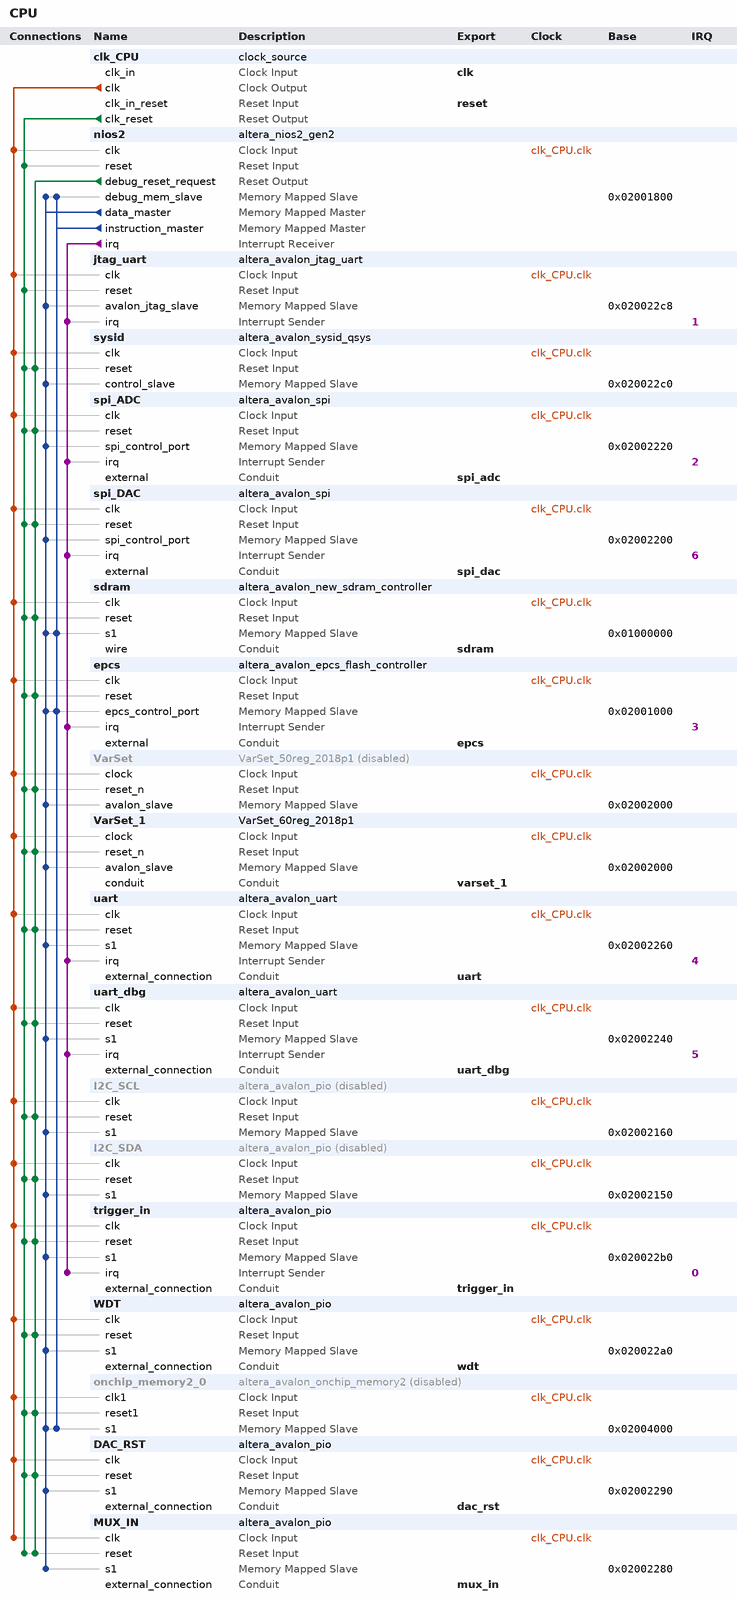
[diagram p0: system contents]
# Platform Designer (Qsys) system CPU, Cyclone IV E EP4CE40F23I7
# Parameters at their usual value, and those the tool derives, are not listed.
package require -exact qsys 18.1
create_system CPU
set_project_property DEVICE_FAMILY {Cyclone IV E}
set_project_property DEVICE EP4CE40F23I7

add_instance clk_CPU clock_source 18.1
set_instance_parameter_value clk_CPU clockFrequency 100000000

add_instance nios2 altera_nios2_gen2 18.1
set_instance_parameter_value nios2 dcache_size 2048
set_instance_parameter_value nios2 exceptionSlave sdram.s1
set_instance_parameter_value nios2 icache_size 4096
set_instance_parameter_value nios2 impl Tiny
set_instance_parameter_value nios2 resetSlave epcs.epcs_control_port

add_instance jtag_uart altera_avalon_jtag_uart 18.1
set_instance_parameter_value jtag_uart simInteractiveOptions NO_INTERACTIVE_WINDOWS

add_instance sysid altera_avalon_sysid_qsys 18.1
set_instance_parameter_value sysid id 16777216

add_instance spi_ADC altera_avalon_spi 18.1
set_instance_parameter_value spi_ADC clockPolarity 0
set_instance_parameter_value spi_ADC dataWidth 16
set_instance_parameter_value spi_ADC masterSPI true
set_instance_parameter_value spi_ADC numberOfSlaves 2
set_instance_parameter_value spi_ADC targetClockRate 1000000

add_instance spi_DAC altera_avalon_spi 18.1
set_instance_parameter_value spi_DAC clockPolarity 0
set_instance_parameter_value spi_DAC dataWidth 16
set_instance_parameter_value spi_DAC masterSPI true
set_instance_parameter_value spi_DAC numberOfSlaves 2
set_instance_parameter_value spi_DAC targetClockRate 1000000

add_instance sdram altera_avalon_new_sdram_controller 18.1
set_instance_parameter_value sdram TAC 5.4
set_instance_parameter_value sdram TRCD 18.0
set_instance_parameter_value sdram TRFC 60.0
set_instance_parameter_value sdram TRP 18.0
set_instance_parameter_value sdram casLatency 3
set_instance_parameter_value sdram columnWidth 9
set_instance_parameter_value sdram dataWidth 16
set_instance_parameter_value sdram generateSimulationModel false
set_instance_parameter_value sdram model single_Micron_MT48LC4M32B2_7_chip
set_instance_parameter_value sdram numberOfBanks 4
set_instance_parameter_value sdram numberOfChipSelects 1
set_instance_parameter_value sdram powerUpDelay 100.0
set_instance_parameter_value sdram refreshPeriod 15.625
set_instance_parameter_value sdram rowWidth 12

add_instance epcs altera_avalon_epcs_flash_controller 18.1
set_instance_parameter_value epcs resetrequest_enabled true

add_instance VarSet VarSet_50reg_2018p1 1.0
set_instance_property VarSet ENABLED false

add_instance VarSet_1 VarSet_60reg_2018p1 2.0

add_instance uart altera_avalon_uart 18.1
set_instance_parameter_value uart baud 115200
set_instance_parameter_value uart dataBits 8
set_instance_parameter_value uart fixedBaud false
set_instance_parameter_value uart parity NONE
set_instance_parameter_value uart stopBits 1

add_instance uart_dbg altera_avalon_uart 18.1
set_instance_parameter_value uart_dbg baud 115200
set_instance_parameter_value uart_dbg dataBits 8
set_instance_parameter_value uart_dbg fixedBaud true
set_instance_parameter_value uart_dbg parity NONE
set_instance_parameter_value uart_dbg stopBits 1

add_instance I2C_SCL altera_avalon_pio 18.1
set_instance_property I2C_SCL ENABLED false
set_instance_parameter_value I2C_SCL direction Output
set_instance_parameter_value I2C_SCL width 1

add_instance I2C_SDA altera_avalon_pio 18.1
set_instance_property I2C_SDA ENABLED false
set_instance_parameter_value I2C_SDA direction Bidir
set_instance_parameter_value I2C_SDA width 1

add_instance trigger_in altera_avalon_pio 18.1
set_instance_parameter_value trigger_in bitClearingEdgeCapReg true
set_instance_parameter_value trigger_in captureEdge true
set_instance_parameter_value trigger_in direction Input
set_instance_parameter_value trigger_in generateIRQ true
set_instance_parameter_value trigger_in irqType EDGE
set_instance_parameter_value trigger_in width 1

add_instance WDT altera_avalon_pio 18.1
set_instance_parameter_value WDT direction Output
set_instance_parameter_value WDT width 2

add_instance onchip_memory2_0 altera_avalon_onchip_memory2 18.1
set_instance_property onchip_memory2_0 ENABLED false
set_instance_parameter_value onchip_memory2_0 dataWidth 32
set_instance_parameter_value onchip_memory2_0 dualPort false
set_instance_parameter_value onchip_memory2_0 initMemContent true
set_instance_parameter_value onchip_memory2_0 initializationFileName onchip_mem.hex
set_instance_parameter_value onchip_memory2_0 memorySize 16384

add_instance DAC_RST altera_avalon_pio 18.1
set_instance_parameter_value DAC_RST direction Output
set_instance_parameter_value DAC_RST resetValue 1
set_instance_parameter_value DAC_RST width 1

add_instance MUX_IN altera_avalon_pio 18.1
set_instance_parameter_value MUX_IN direction Output
set_instance_parameter_value MUX_IN width 2

# connections
add_connection clk_CPU.clk DAC_RST.clk clock
add_connection clk_CPU.clk epcs.clk clock
add_connection clk_CPU.clk I2C_SCL.clk clock
add_connection clk_CPU.clk I2C_SDA.clk clock
add_connection clk_CPU.clk jtag_uart.clk clock
add_connection clk_CPU.clk MUX_IN.clk clock
add_connection clk_CPU.clk nios2.clk clock
add_connection clk_CPU.clk onchip_memory2_0.clk1 clock
add_connection clk_CPU.clk sdram.clk clock
add_connection clk_CPU.clk spi_ADC.clk clock
add_connection clk_CPU.clk spi_DAC.clk clock
add_connection clk_CPU.clk sysid.clk clock
add_connection clk_CPU.clk trigger_in.clk clock
add_connection clk_CPU.clk uart.clk clock
add_connection clk_CPU.clk uart_dbg.clk clock
add_connection clk_CPU.clk VarSet.clock clock
add_connection clk_CPU.clk VarSet_1.clock clock
add_connection clk_CPU.clk WDT.clk clock
add_connection clk_CPU.clk_reset DAC_RST.reset reset
add_connection clk_CPU.clk_reset epcs.reset reset
add_connection clk_CPU.clk_reset I2C_SCL.reset reset
add_connection clk_CPU.clk_reset I2C_SDA.reset reset
add_connection clk_CPU.clk_reset jtag_uart.reset reset
add_connection clk_CPU.clk_reset MUX_IN.reset reset
add_connection clk_CPU.clk_reset nios2.reset reset
add_connection clk_CPU.clk_reset onchip_memory2_0.reset1 reset
add_connection clk_CPU.clk_reset sdram.reset reset
add_connection clk_CPU.clk_reset spi_ADC.reset reset
add_connection clk_CPU.clk_reset spi_DAC.reset reset
add_connection clk_CPU.clk_reset sysid.reset reset
add_connection clk_CPU.clk_reset trigger_in.reset reset
add_connection clk_CPU.clk_reset uart.reset reset
add_connection clk_CPU.clk_reset uart_dbg.reset reset
add_connection clk_CPU.clk_reset VarSet.reset_n reset
add_connection clk_CPU.clk_reset VarSet_1.reset_n reset
add_connection clk_CPU.clk_reset WDT.reset reset
add_connection nios2.debug_reset_request DAC_RST.reset reset
add_connection nios2.debug_reset_request epcs.reset reset
add_connection nios2.debug_reset_request I2C_SCL.reset reset
add_connection nios2.debug_reset_request I2C_SDA.reset reset
add_connection nios2.debug_reset_request MUX_IN.reset reset
add_connection nios2.debug_reset_request onchip_memory2_0.reset1 reset
add_connection nios2.debug_reset_request sdram.reset reset
add_connection nios2.debug_reset_request spi_ADC.reset reset
add_connection nios2.debug_reset_request spi_DAC.reset reset
add_connection nios2.debug_reset_request sysid.reset reset
add_connection nios2.debug_reset_request trigger_in.reset reset
add_connection nios2.debug_reset_request uart.reset reset
add_connection nios2.debug_reset_request uart_dbg.reset reset
add_connection nios2.debug_reset_request VarSet.reset_n reset
add_connection nios2.debug_reset_request VarSet_1.reset_n reset
add_connection nios2.debug_reset_request WDT.reset reset
add_connection nios2.data_master DAC_RST.s1 avalon
set_connection_parameter_value nios2.data_master/DAC_RST.s1 baseAddress 0x02002290
add_connection nios2.data_master epcs.epcs_control_port avalon
set_connection_parameter_value nios2.data_master/epcs.epcs_control_port baseAddress 0x02001000
add_connection nios2.data_master I2C_SCL.s1 avalon
set_connection_parameter_value nios2.data_master/I2C_SCL.s1 baseAddress 0x02002160
add_connection nios2.data_master I2C_SDA.s1 avalon
set_connection_parameter_value nios2.data_master/I2C_SDA.s1 baseAddress 0x02002150
add_connection nios2.data_master jtag_uart.avalon_jtag_slave avalon
set_connection_parameter_value nios2.data_master/jtag_uart.avalon_jtag_slave baseAddress 0x020022c8
add_connection nios2.data_master MUX_IN.s1 avalon
set_connection_parameter_value nios2.data_master/MUX_IN.s1 baseAddress 0x02002280
add_connection nios2.data_master nios2.debug_mem_slave avalon
set_connection_parameter_value nios2.data_master/nios2.debug_mem_slave baseAddress 0x02001800
add_connection nios2.data_master onchip_memory2_0.s1 avalon
set_connection_parameter_value nios2.data_master/onchip_memory2_0.s1 baseAddress 0x02004000
add_connection nios2.data_master sdram.s1 avalon
set_connection_parameter_value nios2.data_master/sdram.s1 baseAddress 0x01000000
add_connection nios2.data_master spi_ADC.spi_control_port avalon
set_connection_parameter_value nios2.data_master/spi_ADC.spi_control_port baseAddress 0x02002220
add_connection nios2.data_master spi_DAC.spi_control_port avalon
set_connection_parameter_value nios2.data_master/spi_DAC.spi_control_port baseAddress 0x02002200
add_connection nios2.data_master sysid.control_slave avalon
set_connection_parameter_value nios2.data_master/sysid.control_slave baseAddress 0x020022c0
add_connection nios2.data_master trigger_in.s1 avalon
set_connection_parameter_value nios2.data_master/trigger_in.s1 baseAddress 0x020022b0
add_connection nios2.data_master uart.s1 avalon
set_connection_parameter_value nios2.data_master/uart.s1 baseAddress 0x02002260
add_connection nios2.data_master uart_dbg.s1 avalon
set_connection_parameter_value nios2.data_master/uart_dbg.s1 baseAddress 0x02002240
add_connection nios2.data_master VarSet.avalon_slave avalon
set_connection_parameter_value nios2.data_master/VarSet.avalon_slave baseAddress 0x02002000
add_connection nios2.data_master VarSet_1.avalon_slave avalon
set_connection_parameter_value nios2.data_master/VarSet_1.avalon_slave baseAddress 0x02002000
add_connection nios2.data_master WDT.s1 avalon
set_connection_parameter_value nios2.data_master/WDT.s1 baseAddress 0x020022a0
add_connection nios2.instruction_master epcs.epcs_control_port avalon
set_connection_parameter_value nios2.instruction_master/epcs.epcs_control_port baseAddress 0x02001000
add_connection nios2.instruction_master nios2.debug_mem_slave avalon
set_connection_parameter_value nios2.instruction_master/nios2.debug_mem_slave baseAddress 0x02001800
add_connection nios2.instruction_master onchip_memory2_0.s1 avalon
set_connection_parameter_value nios2.instruction_master/onchip_memory2_0.s1 baseAddress 0x02004000
add_connection nios2.instruction_master sdram.s1 avalon
set_connection_parameter_value nios2.instruction_master/sdram.s1 baseAddress 0x01000000
add_connection nios2.irq epcs.irq interrupt
set_connection_parameter_value nios2.irq/epcs.irq irqNumber 3
add_connection nios2.irq jtag_uart.irq interrupt
set_connection_parameter_value nios2.irq/jtag_uart.irq irqNumber 1
add_connection nios2.irq spi_ADC.irq interrupt
set_connection_parameter_value nios2.irq/spi_ADC.irq irqNumber 2
add_connection nios2.irq spi_DAC.irq interrupt
set_connection_parameter_value nios2.irq/spi_DAC.irq irqNumber 6
add_connection nios2.irq trigger_in.irq interrupt
set_connection_parameter_value nios2.irq/trigger_in.irq irqNumber 0
add_connection nios2.irq uart.irq interrupt
set_connection_parameter_value nios2.irq/uart.irq irqNumber 4
add_connection nios2.irq uart_dbg.irq interrupt
set_connection_parameter_value nios2.irq/uart_dbg.irq irqNumber 5

# exported interfaces
add_interface clk clock sink
set_interface_property clk EXPORT_OF clk_CPU.clk_in
add_interface dac_rst conduit end
set_interface_property dac_rst EXPORT_OF DAC_RST.external_connection
add_interface epcs conduit end
set_interface_property epcs EXPORT_OF epcs.external
add_interface mux_in conduit end
set_interface_property mux_in EXPORT_OF MUX_IN.external_connection
add_interface reset reset sink
set_interface_property reset EXPORT_OF clk_CPU.clk_in_reset
add_interface sdram conduit end
set_interface_property sdram EXPORT_OF sdram.wire
add_interface spi_adc conduit end
set_interface_property spi_adc EXPORT_OF spi_ADC.external
add_interface spi_dac conduit end
set_interface_property spi_dac EXPORT_OF spi_DAC.external
add_interface trigger_in conduit end
set_interface_property trigger_in EXPORT_OF trigger_in.external_connection
add_interface uart conduit end
set_interface_property uart EXPORT_OF uart.external_connection
add_interface uart_dbg conduit end
set_interface_property uart_dbg EXPORT_OF uart_dbg.external_connection
add_interface varset_1 conduit end
set_interface_property varset_1 EXPORT_OF VarSet_1.conduit
add_interface wdt conduit end
set_interface_property wdt EXPORT_OF WDT.external_connection

set_interconnect_requirement {$system} qsys_mm.clockCrossingAdapter HANDSHAKE
set_interconnect_requirement {$system} qsys_mm.enableEccProtection FALSE
set_interconnect_requirement {$system} qsys_mm.insertDefaultSlave FALSE
set_interconnect_requirement {$system} qsys_mm.maxAdditionalLatency 1

save_system CPU.qsys
